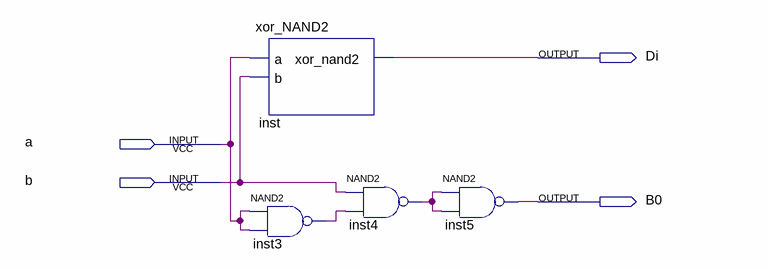
[diagram p0: schematic sheet]
// Quartus schematic semi_minus_NAND2.bdf as structural Verilog: 4 symbols, 4 pins
module semi_minus_NAND2 (
  input  a,
  input  b,
  output Di,
  output B0
);

  wire inst3_out, inst4_out;

  xor_NAND2 inst (.a(a), .b(b), .xor_nand2(Di));
  nand inst3 (inst3_out, a, a);
  nand inst4 (inst4_out, b, inst3_out);
  nand inst5 (B0, inst4_out, inst4_out);
endmodule
